# EAGLE design LampenSteuerung Encoder (EAGLE 7.5.0)
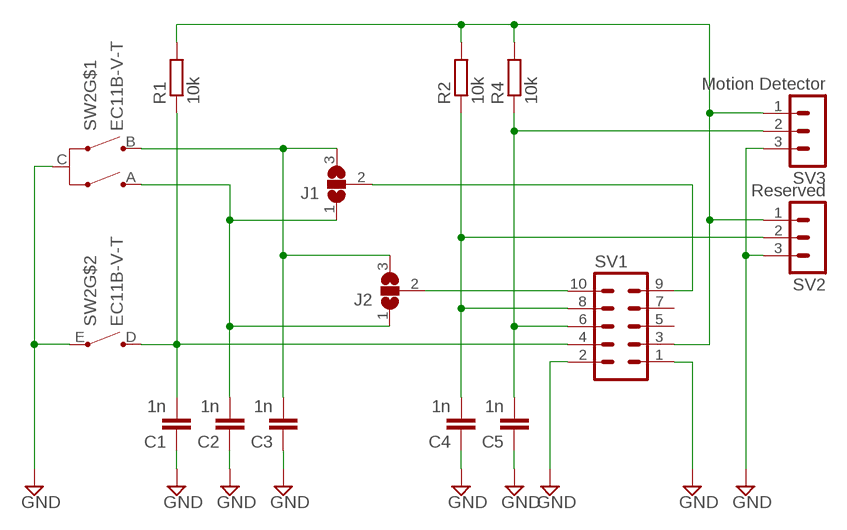
[diagram p0: schematic, sheet 1]

## Parts
C1  1n  C-EUC0603K  [C0603K]
C2  1n  C-EUC0603K  [C0603K]
C3  1n  C-EUC0603K  [C0603K]
C4  1n  C-EUC0603K  [C0603K]
C5  1n  C-EUC0603K  [C0603K]
J1  SJ2W  [SJ_2]
J2  SJ2W  [SJ_2]
R1  10k  R-EU_R0805  [R0805]
R2  10k  R-EU_R0805  [R0805]
R4  10k  R-EU_R0805  [R0805]
SV1  MA05-2  [MA05-2]
SV2  Reserved  MA03-1  [MA03-1]
SV3  Motion Detector  MA03-1  [MA03-1]
SW2  EC11B-V-T  [EC11B-V]

## Nets
GND: C1.1 C2.1 C3.1 C4.1 C5.1 SV1.1 SV1.2 SV2.3 SV3.3 SW2.C SW2.E
N$1: C1.2 R1.1 SV1.4 SW2.D
N$2: C2.2 J1.1 J2.1 SW2.A
N$3: C3.2 J1.3 J2.3 SW2.B
N$4: R1.2 R2.2 R4.2 SV1.3 SV2.1 SV3.1
N$5: C5.2 R4.1 SV1.6 SV3.2
N$6: C4.2 R2.1 SV1.8 SV2.2
N$7: J1.2 SV1.9
N$8: J2.2 SV1.10
Unconnected: SV1.5 SV1.7

## Library data of the parts
C1-C5 = rcl:C-EU: CAPACITOR, European symbol
J1 J2 = jumper:SJ2W: SMD solder JUMPER
R1 R2 R4 = rcl:R-EU_: RESISTOR, European symbol
SV1 = con-lstb:MA05-2: PIN HEADER; OC_FARNELL: unknown; OC_NEWARK: unknown
SV2 SV3 = con-lstb:MA03-1: PIN HEADER; OC_FARNELL: unknown; OC_NEWARK: unknown
SW2 = alps:EC11B-V-T: ALPS EC11B Vertikal mit Taster Drehimpulsgeber 11mm

## Board
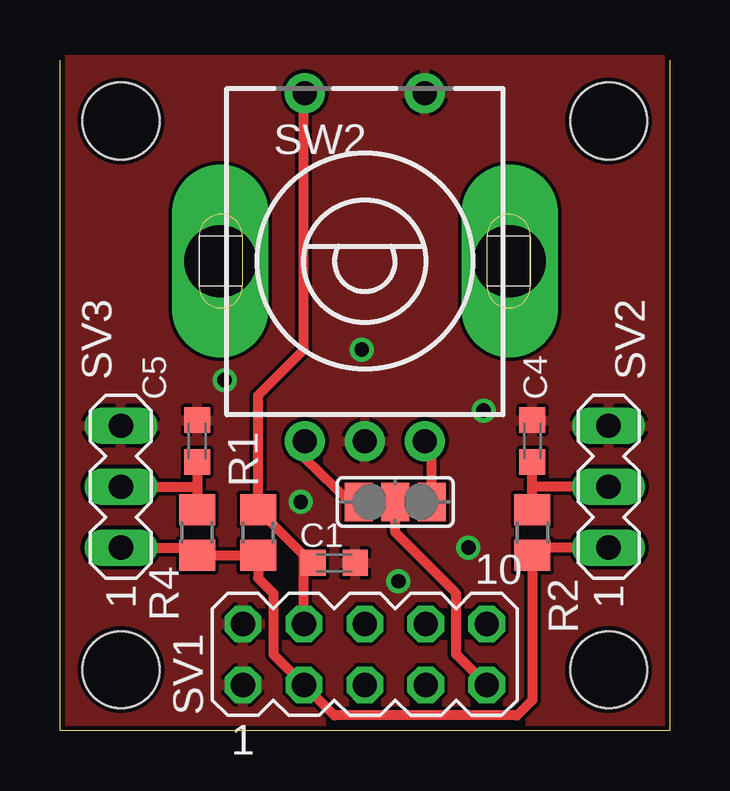
[diagram p1: board, top side]
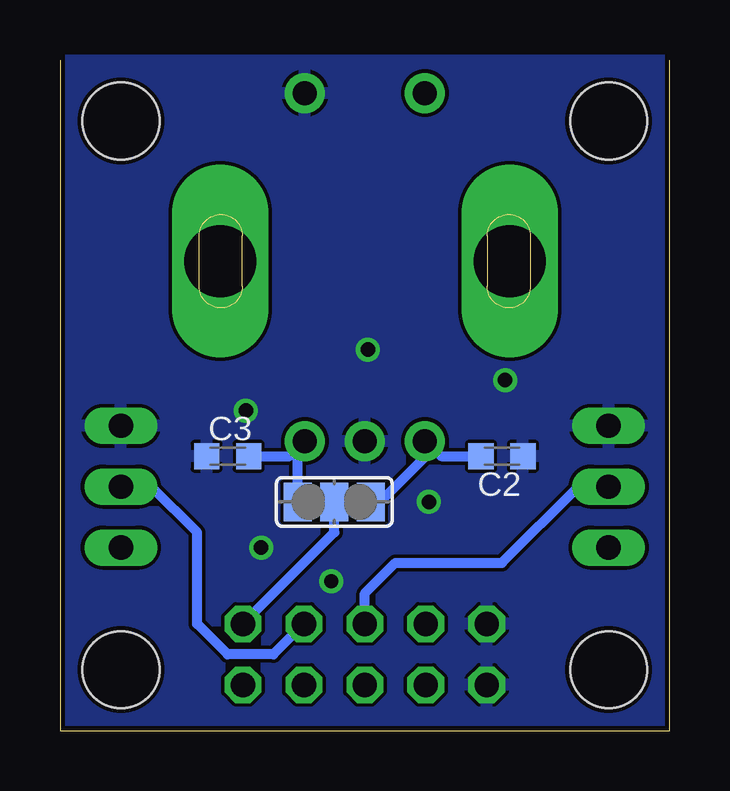
[diagram p2: board, bottom side, seen from below]

Size 25.4 x 27.94 mm. Coordinates in mm from the lower left corner, seen from the top.
Outline: 0,27.94 0,0 25.4,0 25.4,27.94
Copper layers (1*16): Top 0.035mm / dielectric 1.5mm / Bottom 0.035mm
Design rules "platinensammler_03": minimum track width 0.15mm, minimum drill 0.3mm, track to track 0.15mm, track to pad 0.15mm, pad to pad 0.15mm, via to via 0.15mm, smd to smd 0mil, copper to edge 0.2mm, drill to drill 0.2mm, minimum pad ring 0.2mm, minimum via ring 0.2mm, stop-mask expansion 2mil, vias tented up to drill 0.8mm, thermal gap 0.15mm
Holes 3.2 mm at 22.86,2.54 2.54,2.54 2.54,25.4 22.86,25.4

### Footprints (pad centres in the part's own frame; a part is rotated, then mirrored left to right if it is on the bottom)
C0603K = smd 1.05 x 1.08: 1 -0.875,0; 2 0.875,0
SJ_2 = smd 1.168 x 1.6: 1 -1.524,0; 2 0,0; 3 1.524,0
R0805 = smd 1.3 x 1.5: 1 -0.95,0; 2 0.95,0
MA05-2 = drill 1.016 octagon: 1 -5.08,-1.27; 2 -5.08,1.27; 3 -2.54,-1.27; 4 -2.54,1.27; 5 0,-1.27; 6 0,1.27; 7 2.54,-1.27; 8 2.54,1.27; 9 5.08,-1.27; 10 5.08,1.27
MA03-1 = drill 1.016 long: 1 -2.54,0; 2 0,0; 3 2.54,0
EC11B-V = drill 1 pad 1.676: A -2.5,-7.5; B 2.5,-7.5; C 0,-7.5; D -2.5,7; E 2.5,7 | drill 3 pad 3.3 long: G1 -6.032,0; G2 6.032,0

### Placement (x,y rotation side)
C1  11.43,6.99 180 top
C2  6.99,11.43 180 bottom
C3  18.41,11.43 0 bottom
C4  19.68,12.06 270 top
C5  5.71,12.06 270 top
J1  13.97,9.53 0 top
J2  13.97,9.53 180 bottom
R1  8.26,8.26 270 top
R2  19.68,8.26 270 top
R4  5.71,8.26 270 top
SV1  12.7,3.17 0 top
SV2  22.86,10.16 90 top
SV3  2.54,10.16 90 top
SW2  12.7,19.56 0 top

### Tracks (layer width: path | path; a pad name or v marks a point on that pad's centre or on a via)
GND  (via drill 0.6)
  other vias: 14.1,6.22 17.02,7.62 17.65,13.34 6.86,14.61 12.57,15.88 10.03,9.53
  pour Bottom: 25.4,27.94 0,27.94 0,0 25.4,0
  pour Top: 25.4,27.94 0,27.94 0,-0.13 25.4,0
N$1
  Top 0.406: SV1.4 10.16,6.99 | 10.16,6.99 10.16,7.3 R1.1 8.26,13.97 10.16,15.88 10.16,26.52 SW2.D | C1.2 10.16,6.99
N$2
  Top 0.406: SW2.A 10.2,11.34 12.06,9.53 J2.1
  Bottom 0.406: 10.15,12.06 SW2.A 10.16,12.02 10.16,11.43 12.06,9.53 J2.1 | 10.15,12.06 9.53,11.43 C2.2 | 10.15,12.06 10.16,12.06
N$3
  Top 0.406: J1.3 15.49,11.81 | 15.49,11.81 15.24,12.06 | 15.49,11.81 15.45,11.81 SW2.B
  Bottom 0.406: C3.2 15.83,11.43 SW2.B 15.49,11.76 J1.3
N$4
  Top 0.406: SV3.1 5.4,7.62 R4.2 R1.2 8.26,6.35 8.89,5.71 8.89,3.17 SV1.3 11.43,0.64 19.05,0.64 19.68,1.27 R2.2 20,7.62 SV2.1
N$5
  Top 0.406: C5.2 5.71,10.16 | 5.71,10.16 R4.1 | SV3.2 5.71,10.16
  Bottom 0.406: SV1.6 12.7,5.71 11.43,6.99 6.99,6.99 3.81,10.16 SV3.2
N$6
  Top 0.406: R2.1 19.68,10.16 | 19.68,10.16 C4.2 | SV2.2 19.68,10.16
  Bottom 0.406: SV1.8 16.51,3.17 18.41,3.17 19.68,4.45 19.68,8.26 21.59,10.16 SV2.2
N$7
  Top 0.406: SV1.9 16.51,3.17 16.51,5.71 13.97,8.26 J1.2
N$8
  Bottom 0.406: SV1.10 13.97,8.26 J2.2